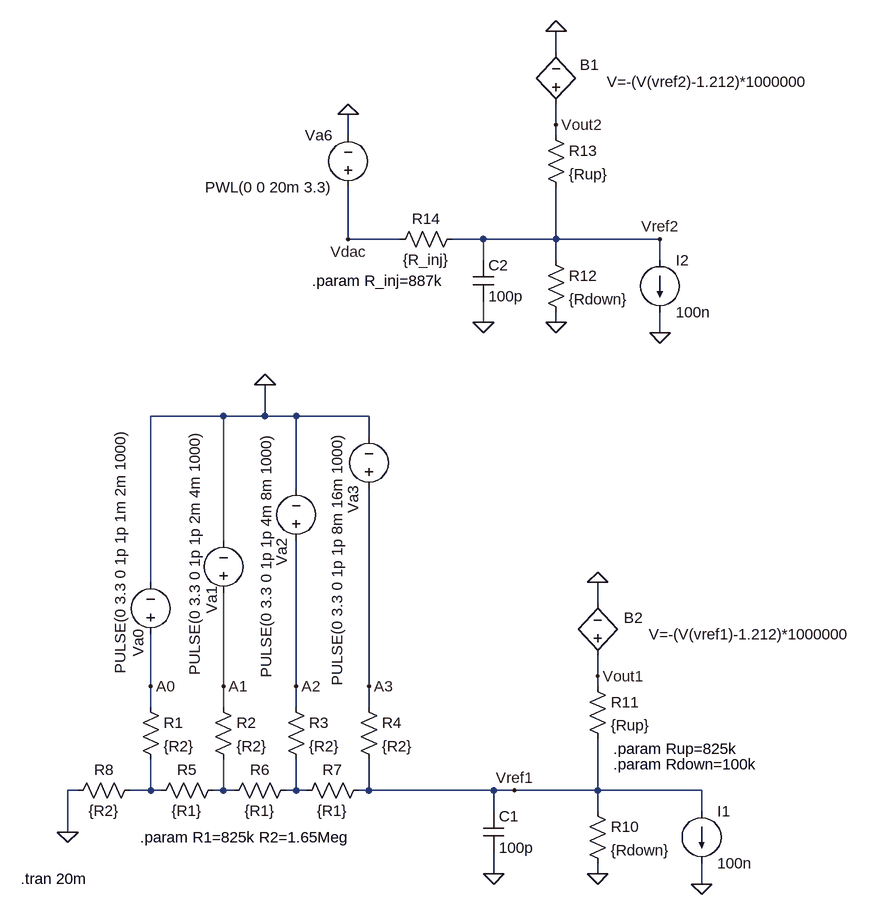
[diagram p0: schematic Rladder.asc]
Rladder.asc, the LTspice schematic file:
Version 4
SHEET 1 1344 680
WIRE 672 -928 672 -960
WIRE 672 -816 672 -848
WIRE 352 -800 352 -832
WIRE 672 -800 672 -816
WIRE 352 -640 352 -720
WIRE 432 -640 352 -640
WIRE 560 -640 512 -640
WIRE 672 -640 672 -720
WIRE 672 -640 560 -640
WIRE 832 -640 672 -640
WIRE 560 -608 560 -640
WIRE 672 -608 672 -640
WIRE 832 -608 832 -640
WIRE 560 -512 560 -544
WIRE 672 -512 672 -528
WIRE 832 -496 832 -528
WIRE 160 -368 48 -368
WIRE 224 -368 224 -416
WIRE 224 -368 160 -368
WIRE 272 -368 224 -368
WIRE 384 -368 272 -368
WIRE 384 -336 384 -368
WIRE 272 -256 272 -368
WIRE 160 -176 160 -368
WIRE 48 -112 48 -368
WIRE 736 -80 736 -112
WIRE 736 32 736 0
WIRE 48 48 48 -32
WIRE 160 48 160 -96
WIRE 272 48 272 -176
WIRE 384 48 384 -256
WIRE 736 48 736 32
WIRE 48 80 48 48
WIRE 160 80 160 48
WIRE 272 80 272 48
WIRE 384 80 384 48
WIRE -64 208 -80 208
WIRE 48 208 48 160
WIRE 48 208 16 208
WIRE 64 208 48 208
WIRE 160 208 160 160
WIRE 160 208 144 208
WIRE 176 208 160 208
WIRE 272 208 272 160
WIRE 272 208 256 208
WIRE 288 208 272 208
WIRE 384 208 384 160
WIRE 384 208 368 208
WIRE 576 208 384 208
WIRE 608 208 576 208
WIRE 736 208 736 128
WIRE 736 208 608 208
WIRE 896 208 736 208
WIRE 576 240 576 208
WIRE 736 240 736 208
WIRE 896 240 896 208
WIRE -80 272 -80 208
WIRE 576 336 576 304
WIRE 736 336 736 320
WIRE 896 352 896 320
FLAG -80 272 0
FLAG 608 208 Vref1
FLAG 48 48 A0
FLAG 160 48 A1
FLAG 272 48 A2
FLAG 384 48 A3
FLAG 576 336 0
FLAG 736 336 0
FLAG 736 -112 0
FLAG 896 352 0
FLAG 672 -512 0
FLAG 672 -960 0
FLAG 832 -496 0
FLAG 832 -640 Vref2
FLAG 352 -832 0
FLAG 736 32 Vout1
FLAG 672 -816 Vout2
FLAG 352 -640 Vdac
FLAG 224 -416 0
FLAG 560 -512 0
SYMBOL res 32 64 R0
SYMATTR InstName R1
SYMATTR Value {R2}
SYMBOL res 144 64 R0
SYMATTR InstName R2
SYMATTR Value {R2}
SYMBOL res 256 64 R0
SYMATTR InstName R3
SYMATTR Value {R2}
SYMBOL res 368 64 R0
SYMATTR InstName R4
SYMATTR Value {R2}
SYMBOL res 160 192 R90
WINDOW 0 0 56 VBottom 2
WINDOW 3 32 56 VTop 2
SYMATTR InstName R5
SYMATTR Value {R1}
SYMBOL res 272 192 R90
WINDOW 0 0 56 VBottom 2
WINDOW 3 32 56 VTop 2
SYMATTR InstName R6
SYMATTR Value {R1}
SYMBOL res 384 192 R90
WINDOW 0 0 56 VBottom 2
WINDOW 3 32 56 VTop 2
SYMATTR InstName R7
SYMATTR Value {R1}
SYMBOL res 32 192 R90
WINDOW 0 0 56 VBottom 2
WINDOW 3 32 56 VTop 2
SYMATTR InstName R8
SYMATTR Value {R2}
SYMBOL voltage 384 -240 R180
WINDOW 0 24 -22 VRight 2
WINDOW 3 49 -288 VRight 2
WINDOW 123 0 0 Left 0
WINDOW 39 0 0 Left 0
SYMATTR InstName Va3
SYMATTR Value PULSE(0 3.3 0 1p 1p 8m 16m 1000)
SYMBOL voltage 272 -160 R180
WINDOW 0 22 -23 VRight 2
WINDOW 3 46 -195 VRight 2
WINDOW 123 0 0 Left 0
WINDOW 39 0 0 Left 0
SYMATTR InstName Va2
SYMATTR Value PULSE(0 3.3 0 1p 1p 4m 8m 1000)
SYMBOL voltage 160 -80 R180
WINDOW 0 18 -17 VRight 2
WINDOW 3 44 -111 VRight 2
WINDOW 123 0 0 Left 0
WINDOW 39 0 0 Left 0
SYMATTR InstName Va1
SYMATTR Value PULSE(0 3.3 0 1p 1p 2m 4m 1000)
SYMBOL voltage 48 -16 R180
WINDOW 0 19 -19 VRight 2
WINDOW 3 47 -45 VRight 2
WINDOW 123 0 0 Left 0
WINDOW 39 0 0 Left 0
SYMATTR InstName Va0
SYMATTR Value PULSE(0 3.3 0 1p 1p 1m 2m 1000)
SYMBOL cap 560 240 R0
SYMATTR InstName C1
SYMATTR Value 100p
SYMBOL res 720 224 R0
SYMATTR InstName R10
SYMATTR Value {Rdown}
SYMBOL res 720 32 R0
SYMATTR InstName R11
SYMATTR Value {Rup}
SYMBOL current 896 240 R0
SYMATTR InstName I1
SYMATTR Value 100n
SYMBOL res 656 -624 R0
SYMATTR InstName R12
SYMATTR Value {Rdown}
SYMBOL res 656 -816 R0
SYMATTR InstName R13
SYMATTR Value {Rup}
SYMBOL current 832 -608 R0
SYMATTR InstName I2
SYMATTR Value 100n
SYMBOL res 528 -656 R90
WINDOW 0 0 56 VBottom 2
WINDOW 3 32 56 VTop 2
SYMATTR InstName R14
SYMATTR Value {R_inj}
SYMBOL voltage 352 -704 R180
WINDOW 0 24 96 Left 2
WINDOW 3 24 16 Left 2
WINDOW 123 0 0 Left 0
WINDOW 39 0 0 Left 0
SYMATTR InstName Va6
SYMATTR Value PWL(0 0 20m 3.3)
SYMBOL bv 672 -832 R180
WINDOW 0 -66 76 Left 2
WINDOW 3 -392 50 Left 2
SYMATTR InstName B1
SYMATTR Value V=-(V(vref2)-1.212)*1000000
SYMBOL bv 736 16 R180
WINDOW 0 -70 74 Left 2
WINDOW 3 -392 48 Left 2
SYMATTR InstName B2
SYMATTR Value V=-(V(vref1)-1.212)*1000000
SYMBOL cap 544 -608 R0
SYMATTR InstName C2
SYMATTR Value 100p
TEXT -152 344 Left 2 !.tran 20m
TEXT 32 280 Left 2 !.param R1=825k R2=1.65Meg
TEXT 760 144 Left 2 !.param Rup=825k
TEXT 296 -576 Left 2 !.param R_inj=887k
TEXT 760 168 Left 2 !.param Rdown=100k

The netlist it stands for:
* Rladder.asc
R1 A0 N001 {R2}
R2 A1 N002 {R2}
R3 A2 N003 {R2}
R4 A3 Vref1 {R2}
R5 N002 N001 {R1}
R6 N003 N002 {R1}
R7 Vref1 N003 {R1}
R8 N001 0 {R2}
Va3 A3 0 PULSE(0 3.3 0 1p 1p 8m 16m 1000)
Va2 A2 0 PULSE(0 3.3 0 1p 1p 4m 8m 1000)
Va1 A1 0 PULSE(0 3.3 0 1p 1p 2m 4m 1000)
Va0 A0 0 PULSE(0 3.3 0 1p 1p 1m 2m 1000)
C1 Vref1 0 100p
R10 Vref1 0 {Rdown}
R11 Vout1 Vref1 {Rup}
I1 Vref1 0 100n
R12 Vref2 0 {Rdown}
R13 Vout2 Vref2 {Rup}
I2 Vref2 0 100n
R14 Vref2 Vdac {R_inj}
Va6 Vdac 0 PWL(0 0 20m 3.3)
B1 Vout2 0 V=-(V(vref2)-1.212)*1000000
B2 Vout1 0 V=-(V(vref1)-1.212)*1000000
C2 Vref2 0 100p
.tran 20m
.param R1=825k R2=1.65Meg
.param Rup=825k
.param R_inj=887k
.param Rdown=100k
.backanno
.end